# Altium schematic sheet Shematic digital clock.SchDoc
size A; SheetNumber: 1; SheetTotal: 1
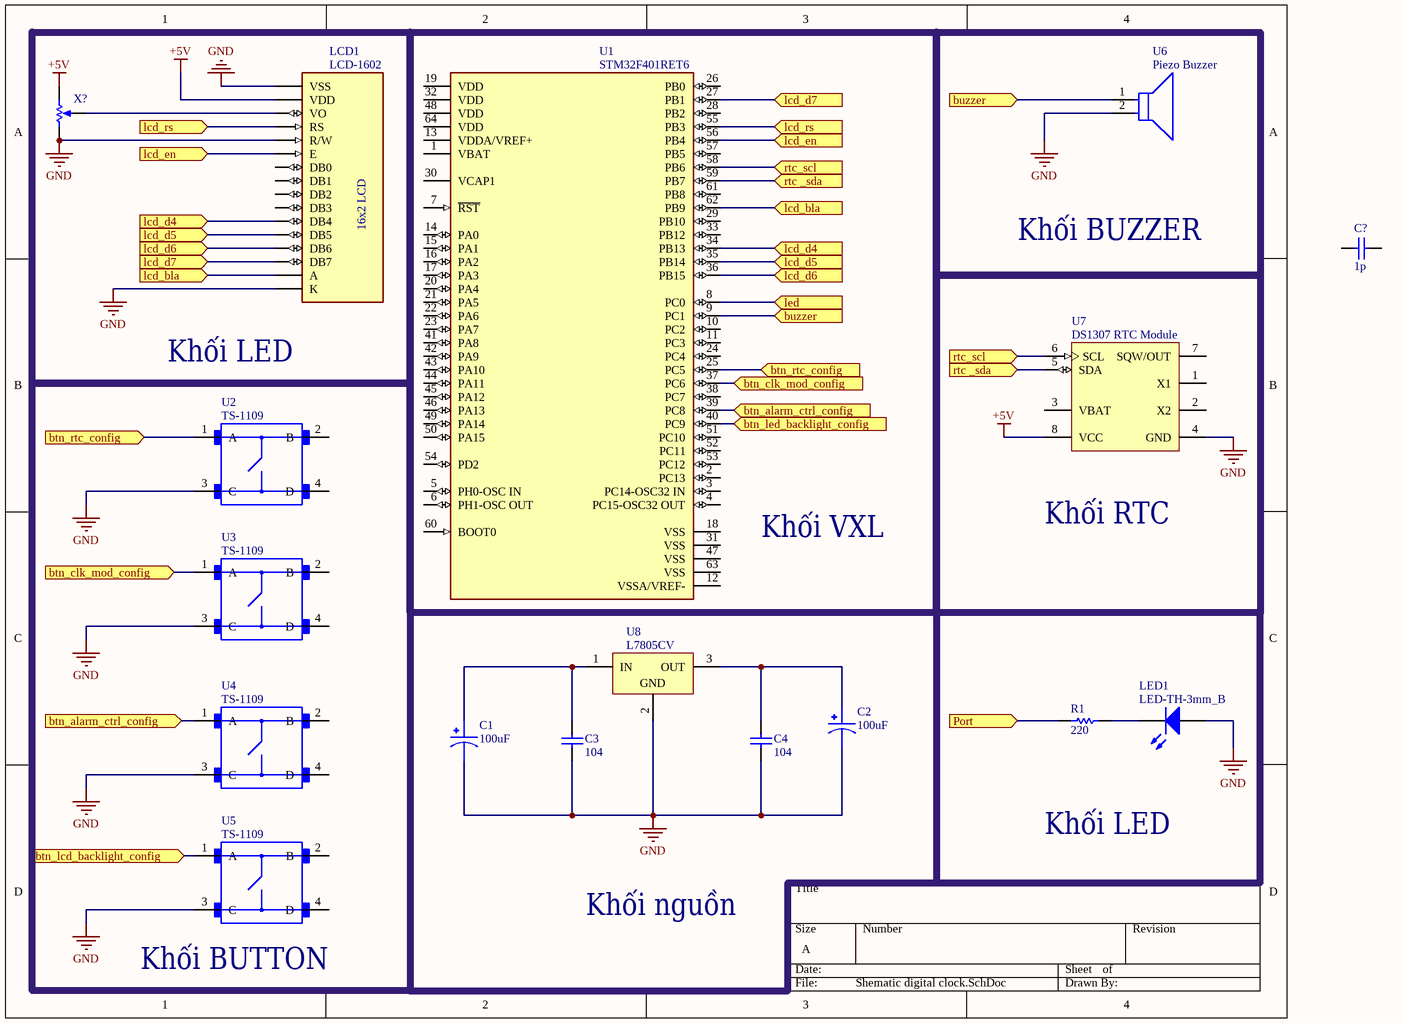
[diagram p0: Shematic digital clock.SchDoc]

## Parts
C1  100uF  [CAPPRD500W60D1330H2700]
C2  100uF  [CAPPRD500W60D1330H2700]
C3  value 104  (hidden comment: Capacitor)
C4  104
C?  value 1p  (hidden comment: Capacitor)
LCD1  LCD-1602  [MODULE_LCD-16X2]
LED1  LED-TH-3mm_B
R1  value 220  (hidden comment: Resistor)
U1  STM32F401RET6  [FP-LQFP64-5W-IPC_A]
U2  TS-1109  [SW_TS-1109]
U3  TS-1109  [SW_TS-1109]
U4  TS-1109  [SW_TS-1109]
U5  TS-1109  [SW_TS-1109]
U6  Piezo Buzzer  [FP-PKLCS1212E2000-R1-MFG]
U7  DS1307 RTC Module  [S8+2_L]
U8  L7805CV  [TO220]
X?  Potentiometer  (value not drawn)

## Sub-sheets
Designator = File Name: no entries
Designator = File Name: no entries
Designator = File Name: no entries
Designator = File Name: no entries
Designator = File Name: no entries

## Ports
btn_alarm_ctrl_config (in, see Sheet1[1C]), btn_alarm_ctrl_config (in, see Sheet1[3B]), btn_clk_mod_config (in, see Sheet1[1C]), btn_clk_mod_config (in, see Sheet1[3B]), btn_lcd_backlight_config (in), btn_led_backlight_config (in), btn_rtc_config (in, see Sheet1[1B]), btn_rtc_config (in, see Sheet1[3B]), buzzer (in, see Sheet1[3A]), buzzer (in, see Sheet1[3B]), lcd_bla (in, see Sheet1[1B]), lcd_bla (in, see Sheet1[3A]), lcd_d4 (in, see Sheet1[1A]), lcd_d4 (in, see Sheet1[3A]), lcd_d5 (in, see Sheet1[1A]), lcd_d5 (in, see Sheet1[3B]), lcd_d6 (in, see Sheet1[1A]), lcd_d6 (in, see Sheet1[3B]), lcd_d7 (in, see Sheet1[1B]), lcd_d7 (in, see Sheet1[3A]), lcd_en (in, see Sheet1[1A]), lcd_en (in, see Sheet1[3A]), lcd_rs (in, see Sheet1[1A]), lcd_rs (in, see Sheet1[3A]), led (in), Port (in), rtc _sda (in, see Sheet1[3A]), rtc _sda (in, see Sheet1[3B]), rtc_scl (in, see Sheet1[3A]), rtc_scl (in, see Sheet1[3B])

## Nets
+5V: LCD1.2(VDD) U7.8(VCC) X?.2(BOT)
GND: C1.2 C2.2 C3.2 C4.1 LCD1.1(VSS) LCD1.5(R/W) LCD1.16(K) LED1.1(A) U2.3(C) U3.3(C) U4.3(C) U5.3(C) U6.2 U7.4(GND) U8.2(GND) X?.1(TOP)
btn_alarm_ctrl_config: U1.39(PC8) U4.1(A) ; port btn_alarm_ctrl_config
btn_clk_mod_config: U1.37(PC6) U3.1(A) ; port btn_clk_mod_config
btn_lcd_backlight_config: U5.1(A) ; port btn_lcd_backlight_config
btn_led_backlight_config: U1.40(PC9) ; port btn_led_backlight_config
btn_rtc_config: U1.25(PC5) U2.1(A) ; port btn_rtc_config
buzzer: U1.9(PC1) U6.1 ; port buzzer
lcd_bla: LCD1.15(A) U1.62(PB9) ; port lcd_bla
lcd_d4: LCD1.11(DB4) U1.34(PB13) ; port lcd_d4
lcd_d5: LCD1.12(DB5) U1.35(PB14) ; port lcd_d5
lcd_d6: LCD1.13(DB6) U1.36(PB15) ; port lcd_d6
lcd_d7: LCD1.14(DB7) U1.27(PB1) ; port lcd_d7
lcd_en: LCD1.6(E) U1.56(PB4) ; port lcd_en
lcd_rs: LCD1.4(RS) U1.55(PB3) ; port lcd_rs
led: U1.8(PC0) ; port led
Port: R1.1 ; port Port
rtc _sda: U1.59(PB7) U7.5(SDA) ; port rtc _sda
rtc_scl: U1.58(PB6) U7.6(SCL) ; port rtc_scl
NetC1_1: C1.1 C3.1 U8.1(IN)
NetC2_1: C2.1 C4.2 U8.3(OUT)
NetLCD1_3: LCD1.3(VO) X?.3(TAP)
NetLED1_2: LED1.2(K) R1.2

Not connected (* = marked no-connect by the designer): C? 1 2; LCD1 7(DB0) 8(DB1) 9(DB2) 10(DB3); U1 1(VBAT) 2(PC13) 3(PC14-OSC32_IN) 4(PC15-OSC32_OUT) 5(PH0-OSC_IN) 6(PH1-OSC_OUT) 7(~{RST}) 10(PC2) 11(PC3) 12(VSSA/VREF-) 13(VDDA/VREF+) 14(PA0) 15(PA1) 16(PA2) 17(PA3) 18(VSS) 19(VDD) 20(PA4) 21(PA5) 22(PA6) 23(PA7) 24(PC4) 26(PB0) 28(PB2) 29(PB10) 30(VCAP1) 31(VSS) 32(VDD) 33(PB12) 38(PC7) 41(PA8) 42(PA9) 43(PA10) 44(PA11) 45(PA12) 46(PA13) 47(VSS) 48(VDD) 49(PA14) 50(PA15) 51(PC10) 52(PC11) 53(PC12) 54(PD2) 57(PB5) 60(BOOT0) 61(PB8) 63(VSS) 64(VDD); U2 2(B) 4(D); U3 2(B) 4(D); U4 2(B) 4(D); U5 2(B) 4(D); U7 1(X1) 2(X2) 3(VBAT) 7(SQW/OUT)

## Notes on the sheet
- Khối BUZZER
- Khối LED
- Khối VXL
- Khối RTC
- (near U5) Khối BUTTON
- Khối nguồn
- (in symbol LCD-16X2) 16x2 LCD

## Library data of the parts
C1 C2 = 478CKS010M: 4700ÂµF 10V Aluminum Electrolytic Capacitors Radial, Can 98.8mOhm @ 120Hz 2000 Hrs @ 85Â°C; MF: Illinois Capacitor; MP: 478CKS010M; SnapEDA_Link: https://www.snapeda.com/parts/478CKS010M/Illinois%20Capacitor/view-part/2347563/?ref=snap; Price: None; Mouser-Purchase-URL: https://snapeda.com/shop?store=Mouser&id=2347563; Availability: Warning; Package: Radial Illinois Capacitor; Value: *
C3 C4 C? = Capacitor: SimulationGenericComponent: True
  C4: Value: 104
LCD1 = LCD-16X2: Display Development Tools 16x2 Black on Green Char LCD w Backlight; MF: Gravitech; Package: None; Price: None; Value: *; SnapEDA_Link: https://www.snapeda.com/parts/LCD-16X2/Gravitech/view-part/?ref=snap; MP: LCD-16X2; Availability: Not in stock; Check_prices: https://www.snapeda.com/parts/LCD-16X2/Gravitech/view-part/?ref=eda
LED1 = LED: AF: 1; BV: 0; BV_MAX: 1e99; EG: 1.11; FC: 0.5; IBV: 0.001; IS: 1e-14; MJSW: 0.33; NTUN: 30; TNOM: 27; XTI: 3; SimulationGenericComponent: True; CJO: 0; CJP: 0; CTA: 0; CTP: 0; FCS: 0.5; FV_MAX: 1e99; IKF: 0; IKR: 0; ISR: 1e-14; JSW: 0; JTUN: 0; JTUNSW: 0; KEG: 1; KF: 0; LEVEL: 1; N: 1; NBV: 1; NR: 1; NS: 1; PHP: 1; RS: 0; TCV: 0; TLEV: 0; TLEVC: 0; TM1: 0; TM2: 0; TPB: 0; TPHP: 0; TRS: 0; TRS2: 0; TT: 0; TTT1: 0; TTT2: 0; VJ: 1; XTITUN: 3
R1 = Resistor: TC1: 0; SimulationGenericComponent: True; TC2: 0
U1 = CMP-12105-000004-1: IC MCU 32BIT 512KB FLASH 64LQFP; Manufacturer: STMicroelectronics; Memory Size: 512KBytes; Number Of Cores: 1; Max Junction Temp: +105°C; Ram Size: 96KBytes; Number Of Adc Channels: 12; Number Of Pwm Channels: 23; Standoff Height: 0.05mm; Frequency: 84MHz; Number Of Timers/Counters: 8; Number Of I/Os: 50; Interface: I2C,SPI,USART,USB,IrDA,I2S,SMBus,Other; Number Of I2C Channels: 3; Max Supply Voltage: 3.6V; Data Bus Width: 32bits; Core Architecture: ARM Cortex-M4; Min Supply Voltage: 1.65V; Category: IC; Device Class L3: Microcontrollers; ComponentLink2URL: https://www.st.com/resource/en/datasheet/stm32f401re.pdf; RoHS: TRUE; Temperature Range High: +105°C; Device Class L2: Embedded Processors and Controllers; ComponentLink2Description: Datasheet; Temperature Range Low: -40°C; Digikey Description: IC MCU 32BIT 512KB FLASH 64LQFP; Package: LQFP64-5W; Manufacturer Part Number: STM32F401RET6; Number Of A/D Converters: 1; Ipc Land Pattern Name: QFP50P1200X1200X160-64; Automotive: No; Ambient Temperature Range Low: -40°C; Height: 1.6mm; Octopart: https://octopart.com/stm32f401ret6-stmicroelectronics-34185993; Ambient Temperature Range High: +85°C; Device Class L1: Integrated Circuits (ICs); Temperature: -40°C to +105°C; Number Of Spi Channels: 3; Number Of Uart Channels: 3; Memory Type: FLASH; Number Of Usb Channels: 1; Lead Free: Yes; Mouser Description: ARM Microcontrollers - MCU 16/32-BITS MICROS
U2-U5 = TS-1109: Heat Sink Full Brick DC/DC Converter Aluminum Top Mount; MF: Samtec Inc.; MP: TS-1109; Price: None; Availability: Unavailable; SnapEDA_Link: https://www.snapeda.com/parts/TS-1109/Samtec%20Inc./view-part/106451/?ref=snap; Value: *; Package: None
U6 = CMP-06202-000001-1: AUDIO PIEZO TRANSDUCER 12.5V SMD; Manufacturer Part Number: PKLCS1212E2000-R1; Manufacturer: Murata; Frequency: 2kHz; Digikey Description: AUDIO PIEZO TRANSDUCER 12.5V SMD; RoHS: TRUE; Device Class L3: Buzzers; Automotive: No; Category: Speak; Height: 3mm; Operating Supply Voltage: 12.5V; Mouser Description: Piezo buzzer SMD | Murata PKLCS1212E2000R1 (Piezo buzzer SMD Signal Generators for PCBs).; Temperature Range High: +70°C; Temperature Range Low: -20°C; ComponentLink2Description: Datasheet; ComponentLink2URL: https://www.murata.com/en-global/products/productdata/8801054425118/SPEC-PKLCS1212E2000-R1.pdf?1517839212000; Package: PKLCS1212E2000-R1; Device Class L1: Electromechanical; Device Class L2: Audio Products; Lead Free: Yes; Temperature: -20°C to +70°C; Octopart: https://octopart.com/pklcs1212e2000-r1-murata-7123179
U7 = CMP-0254-00308-1: 64 x 8, Serial, I2C Real-Time Clock, 5.0V, 8-Pin SO, 0 to 70 degC, Pb-Free; ComponentLink3Description: Package Specification; DatasheetVersion: 10-Feb-2008; Code_IPC: SOIC127P600-8; ComponentLink2Description: Datasheet; Code_JEDEC: MS-012-AA; ComponentLink2URL: http://datasheets.maxim-ic.com/en/ds/DS1307.pdf; ComponentLink3URL: http://pdfserv.maxim-ic.com/package_dwgs/21-0041.PDF; ComponentLink1URL: http://www.maxim-ic.com; PackageReference: S8+2; ComponentLink1Description: Manufacturer URL; PackageDescription: 8-Pin Small-Outline IC, Narrow (0.15in), 1.27 mm Pitch, SOIC (N), Pb-Free; PackageVersion: revC, 2010
U8 = CMP-0244-00483-1: Positive Voltage Regulator, 5V, 3-Pin TO-220; PackageDescription: TO, Thru-Hole, Vertical, Heatsink Mounted; 3 In-Line Leads; Pitch 2.54 mm; ComponentLink2Description: Datasheet; PackageReference: TO220; ComponentLink3URL: http://www.st.com/internet/com/TECHNICAL_RESOURCES/TECHNICAL_LITERATURE/PACKAGE_INFORMATION/CD00004649.pdf; DatasheetVersion: 16/11/2011; ComponentLink1Description: Manufacturer URL; ComponentLink1URL: http://www.st.com; PackageVersion: ver3.0; ComponentLink3Description: Package Specification; ComponentLink2URL: http://www.st.com/internet/com/TECHNICAL_RESOURCES/TECHNICAL_LITERATURE/DATASHEET/CD00000444.pdf
X? = Potentiometer: value: 1k; position: 0.5; SimulationGenericComponent: True